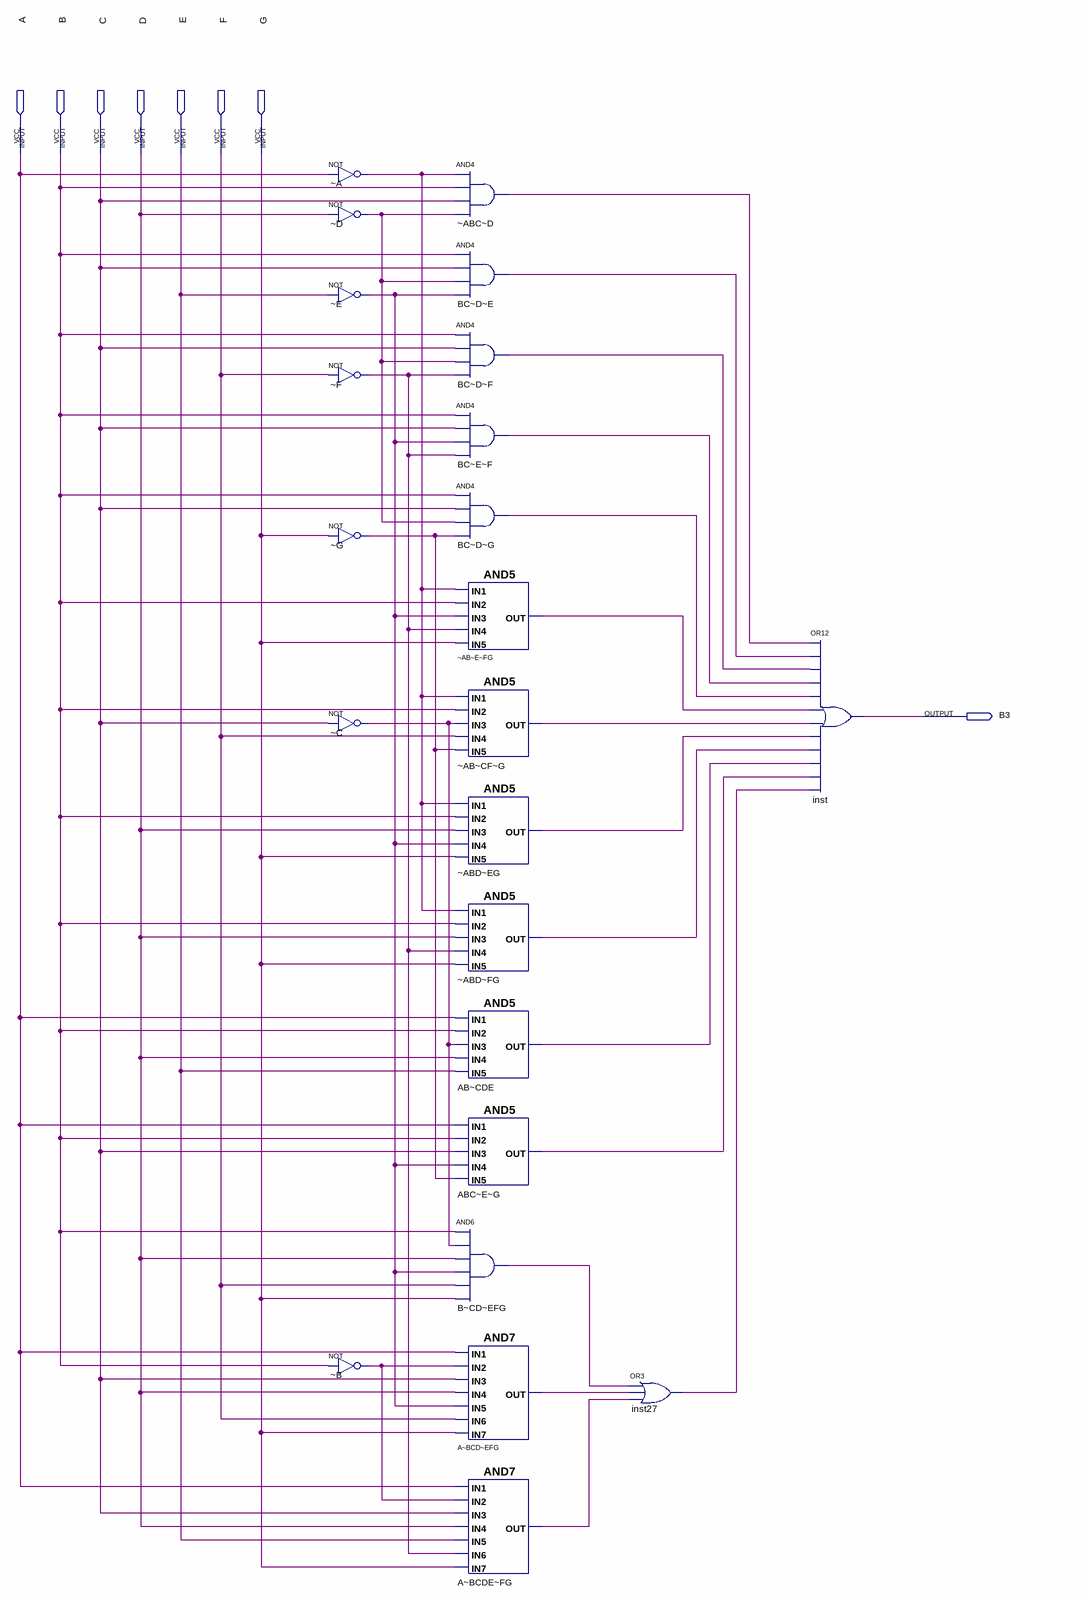
[diagram p0: schematic sheet]
// Quartus schematic posicao3.bdf as structural Verilog: 23 symbols, 8 pins
module posicao3 (
  input  A,
  input  B,
  input  C,
  input  D,
  input  E,
  input  F,
  input  G,
  output B3
);

  wire _A_out, _AB_CF_G_out, _AB_E_FG_out, _ABC_D_out, _ABD_EG_out, _ABD_FG_out, _B_out, _C_out, _D_out,
       _E_out, _F_out, _G_out, A_BCD_EFG_out, A_BCDE_FG_out, AB_CDE_out, ABC_E_G_out, B_CD_EFG_out,
       BC_D_E_out, BC_D_F_out, BC_D_G_out, BC_E_F_out, inst27_out;

  not \u_~A  (_A_out, A);
  not \u_~D  (_D_out, D);
  not \u_~E  (_E_out, E);
  not \u_~F  (_F_out, F);
  not \u_~G  (_G_out, G);
  not \u_~C  (_C_out, C);
  not \u_~B  (_B_out, B);
  and \u_~ABC~D  (_ABC_D_out, _A_out, B, C, _D_out);
  and \BC~D~E  (BC_D_E_out, B, C, _D_out, _E_out);
  and \BC~D~F  (BC_D_F_out, B, C, _D_out, _F_out);
  and \BC~E~F  (BC_E_F_out, B, C, _E_out, _F_out);
  and \BC~D~G  (BC_D_G_out, B, C, _D_out, _G_out);
  and \u_~AB~E~FG  (_AB_E_FG_out, _A_out, B, _E_out, _F_out, G);
  and \u_~AB~CF~G  (_AB_CF_G_out, _A_out, B, _C_out, F, _G_out);
  and \u_~ABD~EG  (_ABD_EG_out, _A_out, B, D, _E_out, G);
  and \u_~ABD~FG  (_ABD_FG_out, _A_out, B, D, _F_out, G);
  and \AB~CDE  (AB_CDE_out, A, B, _C_out, D, E);
  and \ABC~E~G  (ABC_E_G_out, A, B, C, _E_out, _G_out);
  and \B~CD~EFG  (B_CD_EFG_out, B, _C_out, D, _E_out, F, G);
  and \A~BCD~EFG  (A_BCD_EFG_out, A, _B_out, C, D, _E_out, F, G);
  and \A~BCDE~FG  (A_BCDE_FG_out, A, _B_out, C, D, E, _F_out, G);
  or inst27 (inst27_out, B_CD_EFG_out, A_BCD_EFG_out, A_BCDE_FG_out);
  or inst (B3, _ABC_D_out, BC_D_E_out, BC_D_F_out, BC_E_F_out, BC_D_G_out, _AB_E_FG_out, _AB_CF_G_out, _ABD_EG_out, _ABD_FG_out, AB_CDE_out, ABC_E_G_out, inst27_out);
endmodule
